# Altium schematic sheet DMD_Output_Interface.SchDoc
size A3; DrawnBy: Hanif; Organization: AFRA Technology; DocumentNumber: 3; SheetNumber: 3; SheetTotal: 8
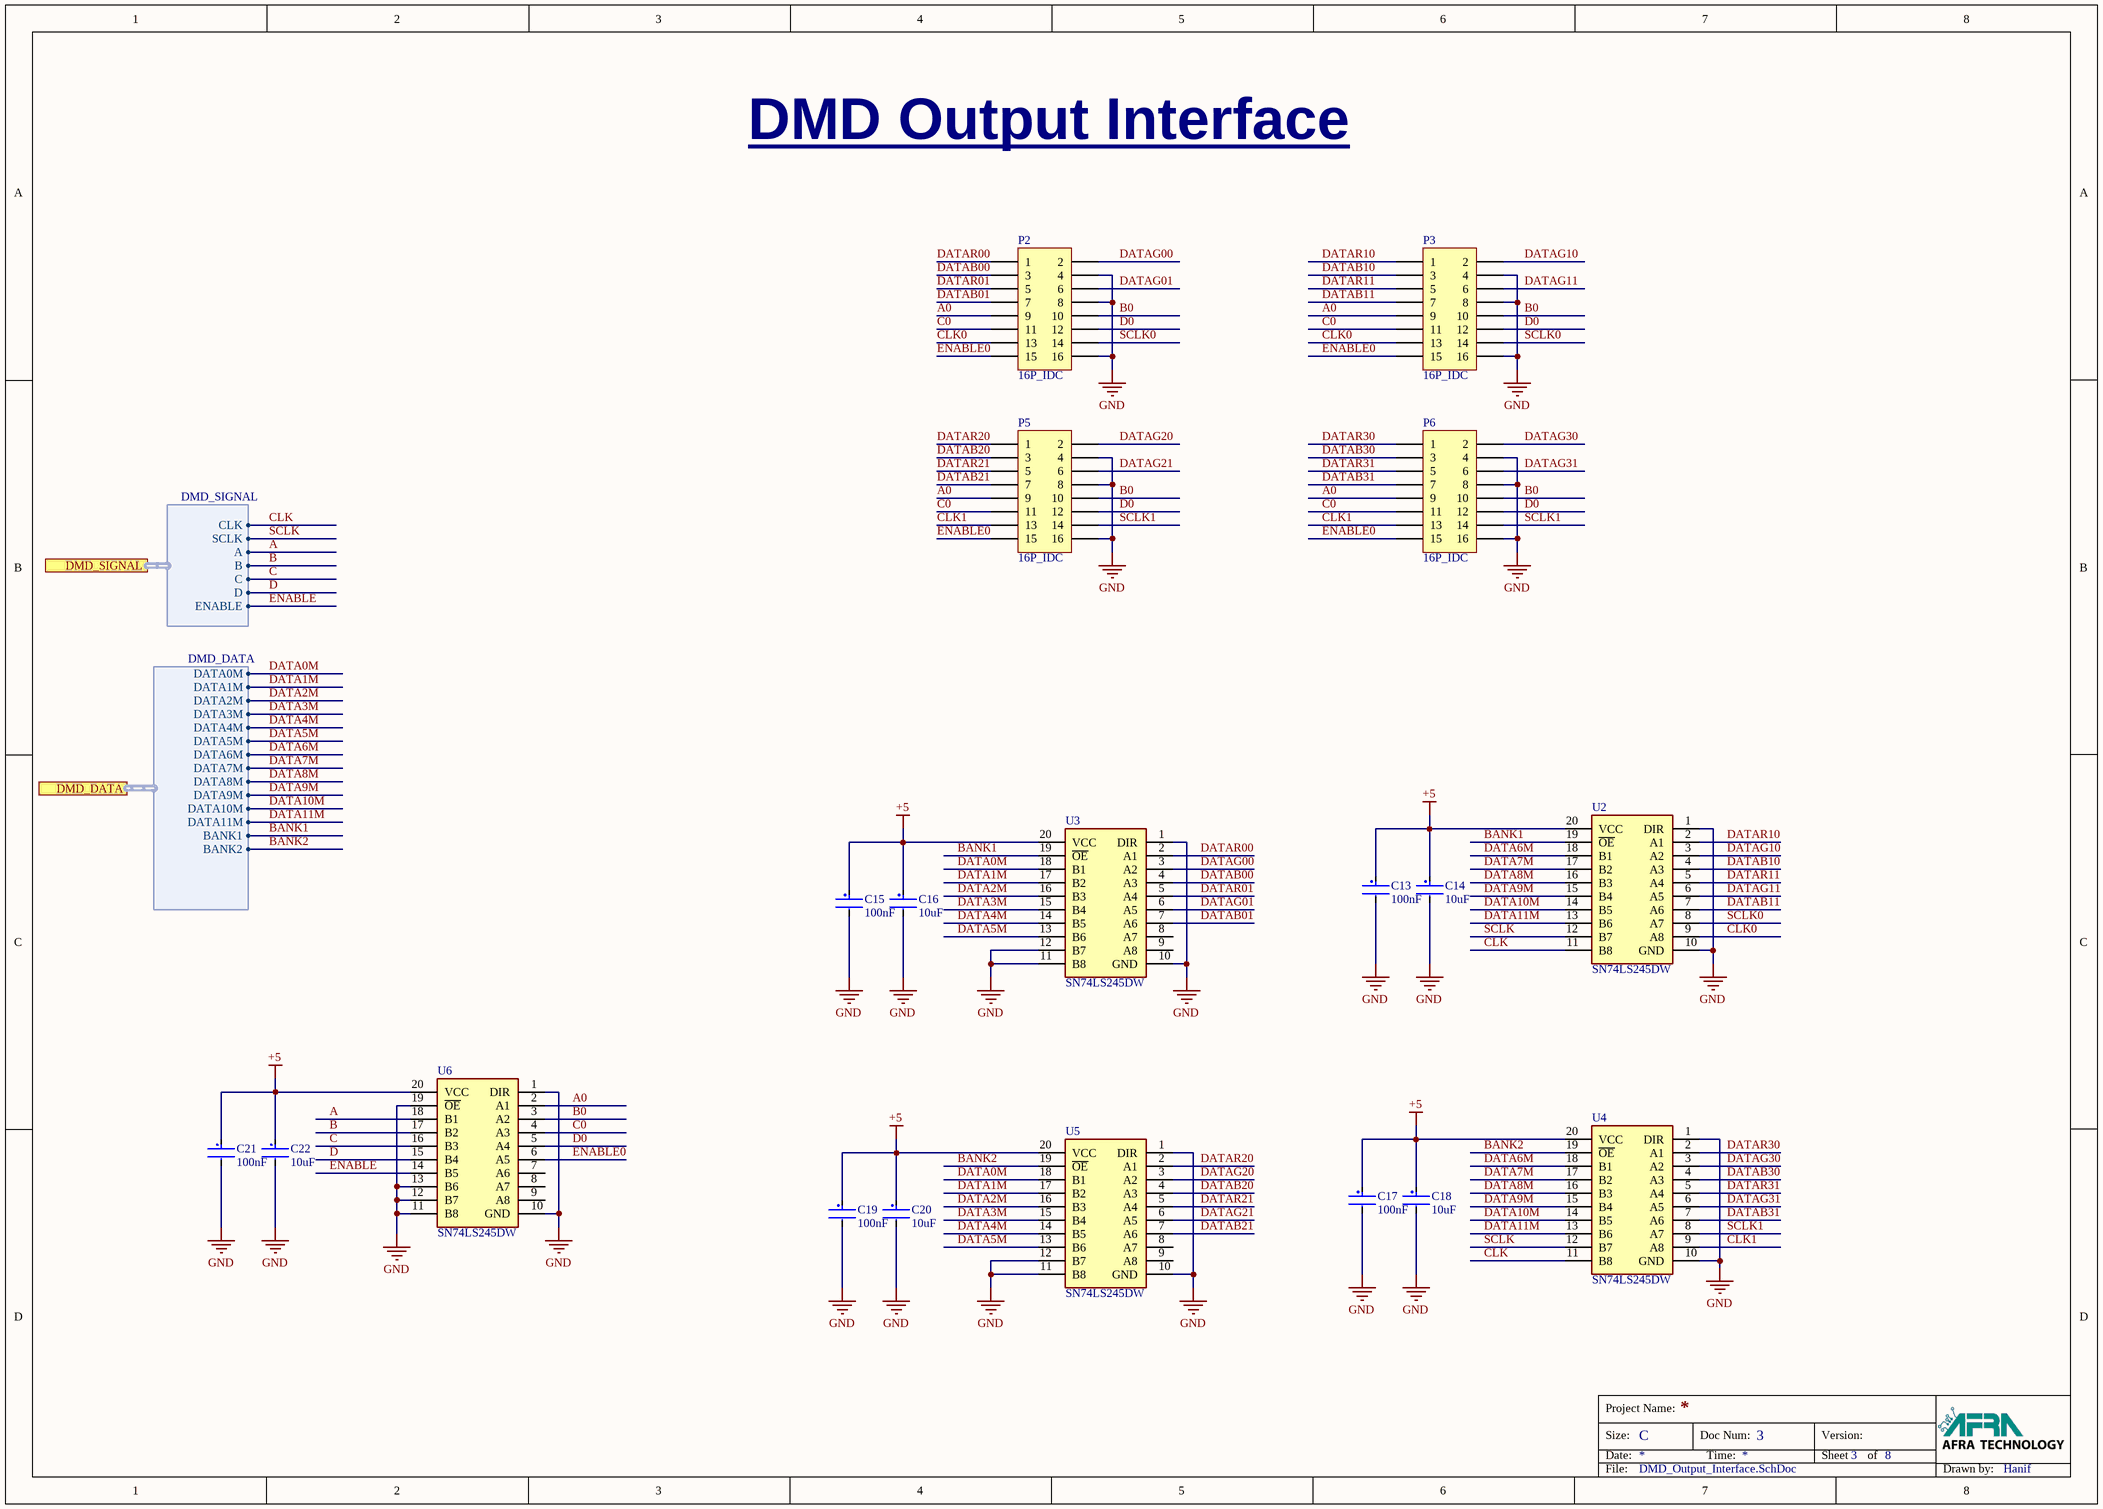
[diagram p0: DMD_Output_Interface.SchDoc]

## Parts
C13  100nF  [Samsung_CL31_IPC_A_1206]
C14  10uF  [Samsung_CL31_IPC_A_1206]
C15  100nF  [Samsung_CL31_IPC_A_1206]
C16  10uF  [Samsung_CL31_IPC_A_1206]
C17  100nF  [Samsung_CL31_IPC_A_1206]
C18  10uF  [Samsung_CL31_IPC_A_1206]
C19  100nF  [Samsung_CL31_IPC_A_1206]
C20  10uF  [Samsung_CL31_IPC_A_1206]
C21  100nF  [Samsung_CL31_IPC_A_1206]
C22  10uF  [Samsung_CL31_IPC_A_1206]
P2  16P_IDC  [16Pin_IDC_Connector]
P3  16P_IDC  [16Pin_IDC_Connector]
P5  16P_IDC  [16Pin_IDC_Connector]
P6  16P_IDC  [16Pin_IDC_Connector]
U2  SN74LS245DW  [SOIC127P1030X265-20N]
U3  SN74LS245DW  [SOIC127P1030X265-20N]
U4  SN74LS245DW  [SOIC127P1030X265-20N]
U5  SN74LS245DW  [SOIC127P1030X265-20N]
U6  SN74LS245DW  [SOIC127P1030X265-20N]

## Ports
DMD_DATA (harness DMD_DATA), DMD_SIGNAL (harness DMD_SIGNAL)

## Harnesses
DMD_SIGNAL: A, B, C, CLK, D, ENABLE, SCLK
DMD_DATA: DATA0M, DATA10M, DATA1M, DATA2M, DATA3M, DATA4M, DATA5M, DATA6M, DATA7M, DATA8M, DATA9M, DATA11M, BANK1, BANK2

## Nets
+5: C13.1 C14.1 C15.1 C16.1 C17.1 C18.1 C19.1 C20.1 C21.1 C22.1 U2.20(VCC) U3.20(VCC) U4.20(VCC) U5.20(VCC) U6.20(VCC)
GND: C13.2 C14.2 C15.2 C16.2 C17.2 C18.2 C19.2 C20.2 C21.2 C22.2 P2.4 P2.8 P2.16 P3.4 P3.8 P3.16 P5.4 P5.8 P5.16 P6.4 P6.8 P6.16 U2.1(DIR) U2.10(GND) U3.1(DIR) U3.10(GND) U3.11(B8) U3.12(B7) U4.1(DIR) U4.10(GND) U5.1(DIR) U5.10(GND) U5.11(B8) U5.12(B7) U6.1(DIR) U6.10(GND) U6.11(B8) U6.12(B7) U6.13(B6) U6.19(~{OE})
A: U6.18(B1) ; port DMD_SIGNAL.A
A0: P2.9 P3.9 P5.9 P6.9 U6.2(A1)
B: U6.17(B2) ; port DMD_SIGNAL.B
B0: P2.10 P3.10 P5.10 P6.10 U6.3(A2)
BANK1: U2.19(~{OE}) U3.19(~{OE}) ; port DMD_DATA.BANK1
BANK2: U4.19(~{OE}) U5.19(~{OE}) ; port DMD_DATA.BANK2
C: U6.16(B3) ; port DMD_SIGNAL.C
C0: P2.11 P3.11 P5.11 P6.11 U6.4(A3)
CLK: U2.11(B8) U4.11(B8) ; port DMD_SIGNAL.CLK
CLK0: P2.13 P3.13 U2.9(A8)
CLK1: P5.13 P6.13 U4.9(A8)
D: U6.15(B4) ; port DMD_SIGNAL.D
D0: P2.12 P3.12 P5.12 P6.12 U6.5(A4)
DATA0M: U3.18(B1) U5.18(B1) ; port DMD_DATA.DATA0M
DATA1M: U3.17(B2) U5.17(B2) ; port DMD_DATA.DATA1M
DATA2M: U3.16(B3) U5.16(B3) ; port DMD_DATA.DATA2M
DATA3M: U3.15(B4) U5.15(B4) ; port DMD_DATA.DATA3M
DATA4M: U3.14(B5) U5.14(B5) ; port DMD_DATA.DATA4M
DATA5M: U3.13(B6) U5.13(B6) ; port DMD_DATA.DATA5M
DATA6M: U2.18(B1) U4.18(B1) ; port DMD_DATA.DATA6M
DATA7M: U2.17(B2) U4.17(B2) ; port DMD_DATA.DATA7M
DATA8M: U2.16(B3) U4.16(B3) ; port DMD_DATA.DATA8M
DATA9M: U2.15(B4) U4.15(B4) ; port DMD_DATA.DATA9M
DATA10M: U2.14(B5) U4.14(B5) ; port DMD_DATA.DATA10M
DATA11M: U2.13(B6) U4.13(B6) ; port DMD_DATA.DATA11M
DATAB00: P2.3 U3.4(A3)
DATAB01: P2.7 U3.7(A6)
DATAB10: P3.3 U2.4(A3)
DATAB11: P3.7 U2.7(A6)
DATAB20: P5.3 U5.4(A3)
DATAB21: P5.7 U5.7(A6)
DATAB30: P6.3 U4.4(A3)
DATAB31: P6.7 U4.7(A6)
DATAG00: P2.2 U3.3(A2)
DATAG01: P2.6 U3.6(A5)
DATAG10: P3.2 U2.3(A2)
DATAG11: P3.6 U2.6(A5)
DATAG20: P5.2 U5.3(A2)
DATAG21: P5.6 U5.6(A5)
DATAG30: P6.2 U4.3(A2)
DATAG31: P6.6 U4.6(A5)
DATAR00: P2.1 U3.2(A1)
DATAR01: P2.5 U3.5(A4)
DATAR10: P3.1 U2.2(A1)
DATAR11: P3.5 U2.5(A4)
DATAR20: P5.1 U5.2(A1)
DATAR21: P5.5 U5.5(A4)
DATAR30: P6.1 U4.2(A1)
DATAR31: P6.5 U4.5(A4)
ENABLE: U6.14(B5) ; port DMD_SIGNAL.ENABLE
ENABLE0: P2.15 P3.15 P5.15 P6.15 U6.6(A5)
SCLK: U2.12(B7) U4.12(B7) ; port DMD_SIGNAL.SCLK
SCLK0: P2.14 P3.14 U2.8(A7)
SCLK1: P5.14 P6.14 U4.8(A7)

Not connected (* = marked no-connect by the designer): U3 8(A7) 9(A8); U5 8(A7) 9(A8); U6 7(A6) 8(A7) 9(A8)

## Notes on the sheet
- DMD Output Interface
- Project Name:
- Size:
- Date:
- C
- Doc Num:
- Time:
- Version:
- Sheet
- of
- File:
- Drawn by:

## Library data of the parts
C13 C15 C17 C19 C21 = CL31B104KBCNFNC: CAP CER 0.1UF 50V X7R 1206, ±10% 50V Ceramic Capacitor X7R 1206 (3216 Metric); Supplier 1: Digi-Key; Supplier Part Number 1: 1276-2744-1-ND
C14 C16 C18 C20 C22 = CL31A106KQHNNWE: CAP CER 10UF 6.3V X5R 1206, ±10% 6.3V Ceramic Capacitor X5R 1206 (3216 Metric); Supplier 1: Digi-Key; Supplier Part Number 1: 1276-3043-1-ND
P2 P3 P5 P6 = BHR-16-VUA: Headers & Wire Housings 16P STRAIGHT; Manufacturer: Adam Equipment; Current Rating: 1A; Number of Positions: 16; Pitch: 2.54mm; Supplier 1: Digi-Key; Manufacturer Part Number: BHR-16-VUA; RoHS: Yes; Category: Connectors; Stock 1: 804; Pricing 1: 1=0.45000, 10=0.42400, 100=0.29690, 500=0.25452, 1000=0.21210, 5000=0.18180, 10000=0.16968 (USD); Contact Plating: Gold; Contact Material: Brass; Package Quantity: 276; Number of Rows: 2; Packaging: Tray; Orientation: Straight; Termination: IDC; Lead Free: Lead Free; ComponentLink1URL: https://datasheet.ciiva.com/16418/page-319-321-16418937.pdf?src-supplier=Future+Electronics; ComponentLink1Description: https://datasheet.ciiva.com/16418/page-319-321-16418937.pdf?src-supplier=Future+Electronics; Supplier Part Number 1: 2057-BHR-16-VUA-ND
U2-U6 = SN74LS245DW: Integrated Circuit; Manufacturer_Name: Texas Instruments; Datasheet Link: http://www.ti.com/lit/gpn/sn74ls245; Height: 2.65mm; Manufacturer_Part_Number: SN74LS245DW; Mouser Part Number: 595-SN74LS245DW; Mouser Price/Stock: https://www.mouser.co.uk/ProductDetail/Texas-Instruments/SN74LS245DW/?qs=ZA235jQDfbpxKQZqDHbgmw%3D%3D; Arrow Part Number: SN74LS245DW; Arrow Price/Stock: https://www.arrow.com/en/products/sn74ls245dw/texas-instruments